# Altium schematic sheet REGENIX_DRIVER_2.SchDoc
size A4; SheetNumber: 12; SheetTotal: 17
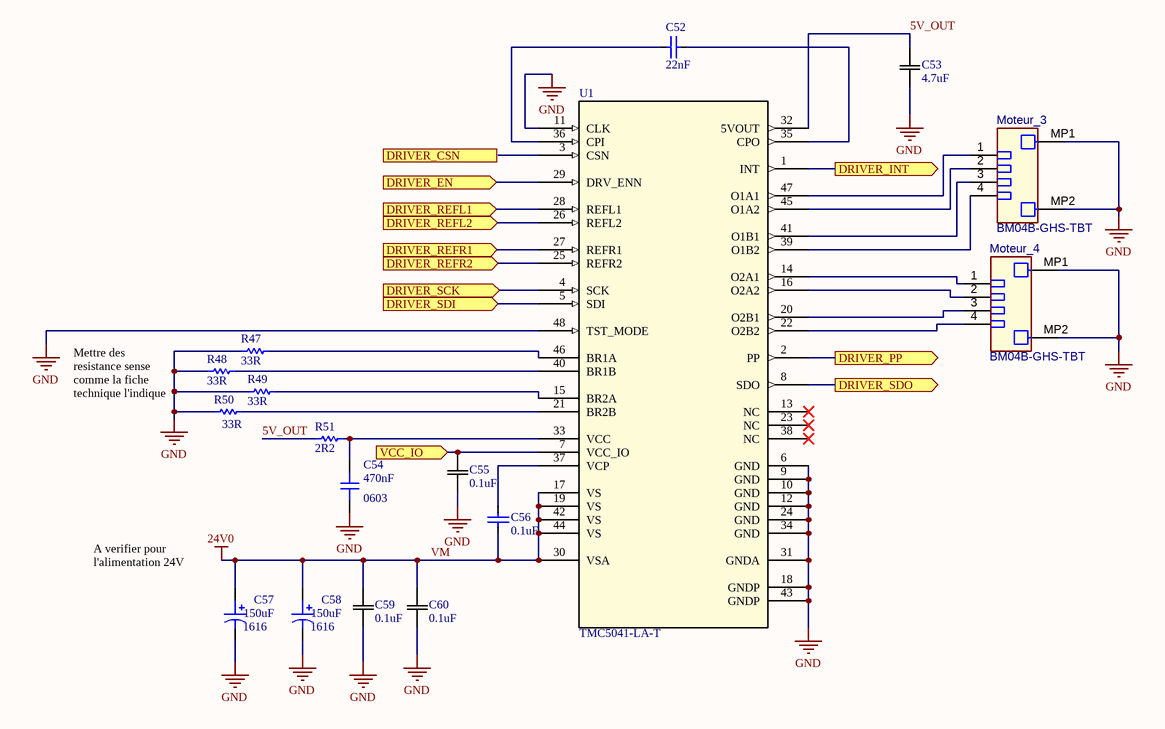
[diagram p0: REGENIX_DRIVER_2.SchDoc]

## Parts
C52  value 22nF  [CAPACITOR-0603]  (hidden comment: Capacitor-0603-0.22uF-25V-X7R)
C53  4.7uF  [CAP_CL21_SAM]
C54  value 470nF  Package: 0603  [CAP_0603]  (hidden comment: CAP - 0603)
C55  0.1uF  [CAP_CL10_SAM]
C56  value 0.1uF  [CAPACITOR-0603]  (hidden comment: Capacitor-0603-0.22uF-25V-X7R)
C57  value 150uF  Package: 1616  [CAP_ALU_1616_vishay]  (hidden comment: MAL214699108E3)
C58  value 150uF  Package: 1616  [CAP_ALU_1616_vishay]  (hidden comment: MAL214699108E3)
C59  0.1uF  [CAP_CL10_SAM]
C60  0.1uF  [CAP_CL10_SAM]
Moteur_3  BM04B-GHS-TBT  [JST-BM04B-GHS-TBT_V]
Moteur_4  BM04B-GHS-TBT  [JST-BM04B-GHS-TBT_V]
R47  value 33R  [RESISTOR-1206]  (hidden comment: SMT resistor)
R48  value 33R  [RESISTOR-1206]  (hidden comment: SMT resistor)
R49  value 33R  [RESISTOR-1206]  (hidden comment: SMT resistor)
R50  value 33R  [RESISTOR-1206]  (hidden comment: SMT resistor)
R51  value 2R2  [Resistor-0603]  (hidden comment: SMT resistor)
U1  TMC5041-LA-T  [QFN48_7X7_TRI]

## Ports
DRIVER_CSN (in), DRIVER_EN (in), DRIVER_INT (out), DRIVER_PP (out), DRIVER_REFL1 (in), DRIVER_REFL2 (in), DRIVER_REFR1 (in), DRIVER_REFR2 (in), DRIVER_SCK (in), DRIVER_SDI (in), DRIVER_SDO (out), VCC_IO (in)

## Nets
GND: C53.1 C54.1 C55.1 C57.2 C58.2 C59.1 C60.1 Moteur_3.MP1 Moteur_3.MP2 Moteur_4.MP1 Moteur_4.MP2 R47.1 R48.1 R49.1 R50.1 U1.6(GND) U1.9(GND) U1.10(GND) U1.11(CLK) U1.12(GND) U1.18(GNDP) U1.24(GND) U1.31(GNDA) U1.34(GND) U1.43(GNDP) U1.48(TST_MODE)
VM: C56.1 C57.1 C58.1 C59.2 C60.2 U1.17(VS) U1.19(VS) U1.30(VSA) U1.42(VS) U1.44(VS)  [also labelled 24V0]
5V_OUT: C53.2 R51.1 U1.32(5VOUT)
DRIVER_EN: U1.29(DRV_ENN) ; port DRIVER_EN
DRIVER_INT: U1.1(INT) ; port DRIVER_INT
DRIVER_PP: U1.2(PP) ; port DRIVER_PP
DRIVER_REFL1: U1.28(REFL1) ; port DRIVER_REFL1
DRIVER_REFL2: U1.26(REFL2) ; port DRIVER_REFL2
DRIVER_REFR1: U1.27(REFR1) ; port DRIVER_REFR1
DRIVER_REFR2: U1.25(REFR2) ; port DRIVER_REFR2
DRIVER_SCK: U1.4(SCK) ; port DRIVER_SCK
DRIVER_SDI: U1.5(SDI) ; port DRIVER_SDI
DRIVER_SDO: U1.8(SDO) ; port DRIVER_SDO
VCC_IO: C55.2 U1.7(VCC_IO) ; port VCC_IO
NetC52_1: C52.1 U1.36(CPI)
NetC52_2: C52.2 U1.35(CPO)
NetC54_2: C54.2 R51.2 U1.33(VCC)
NetC56_2: C56.2 U1.37(VCP)
NetMoteur_3_1: Moteur_3.1 U1.47(O1A1)
NetMoteur_3_2: Moteur_3.2 U1.45(O1A2)
NetMoteur_3_3: Moteur_3.3 U1.41(O1B1)
NetMoteur_3_4: Moteur_3.4 U1.39(O1B2)
NetMoteur_4_1: Moteur_4.1 U1.14(O2A1)
NetMoteur_4_2: Moteur_4.2 U1.16(O2A2)
NetMoteur_4_3: Moteur_4.3 U1.20(O2B1)
NetMoteur_4_4: Moteur_4.4 U1.22(O2B2)
NetR47_2: R47.2 U1.46(BR1A)
NetR48_2: R48.2 U1.40(BR1B)
NetR49_2: R49.2 U1.15(BR2A)
NetR50_2: R50.2 U1.21(BR2B)

Not connected (* = marked no-connect by the designer): U1 3(CSN) 13(NC)* 23(NC)* 38(NC)*

## Notes on the sheet
- Mettre des resistance sense comme la fiche technique l'indique
- (near C57) A verifier pour l'alimentation 24V

## Library data of the parts
C52 C56 = Capacitor-0603-0.22uF-25V-X7R: Precision: X7R-10%; Volt: 25V; Package / Case: Metric 1608, EIA 0603; Mounted: Yes; Supplier 1: Digi-Key; Supplier Part Number 1: 490-4935-2-ND; Supplier 2: Digi-Key; Supplier 3: Digi-Key; Supplier 4: Digi-Key
C53 = CL21A475KAQNNNE: CAP CER 4.7UF 25V X5R 0805  CL21A475KAQNNNE; Mfr_Name: Samsung
C54 = CAP - 0603: Precision: 10%; Current: *; CreatedBy: Jonathan Bouchard; Power: *
C55 C59 C60 = CL10B104KB8NNWC: CAP CER 0.1UF 50V X7R 0603 CL10B104KB8NNWC; Mfr_Name: Samsung
C57 C58 = CAP_ALU_MAL214699108E3: CAP - ALU 470uF 20% 50V - 1616; Current: 1.3A; Mfg: Vishay Dale; Mfg Part Number: MAL214699108E3; HelpURL: http://www.vishay.com/docs/28403/146cti.pdf; CreatedBy: Jonathan Bouchard; Temperature: -55°C to 125°C; Power: *; Supplier 1: Digikey; Supplier Part Number 1: 4442PHCT-ND
Moteur_3 Moteur_4 = CMP-002-00053-3: Header, Pitch 1.25 mm, 1 x 4 Position, Height 4.05 mm, -25 to 85 degC; Pins: 6
R47-R50 = Resistor1206-33R: Precision: 1%; Watt: 0.1W; Mounted: Yes; Package / Case: Metric 3216, EIA 1206; Supplier 2: Digi-Key; Supplier 4: Digi-Key; Supplier 1: Digi-Key; Supplier 3: Digi-Key; Supplier Part Number 1: 311-33.0FRTR-ND
R51 = Resistor0603-22R: Precision: 1%; Watt: 0.1W; Mounted: Yes; Package / Case: Metric 1608, EIA 0603; Supplier 2: Digi-Key; Supplier 4: Digi-Key; Supplier 1: Digi-Key; Supplier 3: Digi-Key; Supplier Part Number 1: RMCF0603FT22R0CT-ND
U1 = TMC5041-LA-T: No Description Available; Mfr_Name: Analog Devices / Trinamic; RefDes: RefDes; Type: Type